# EAGLE design another_one (EAGLE 6.1)
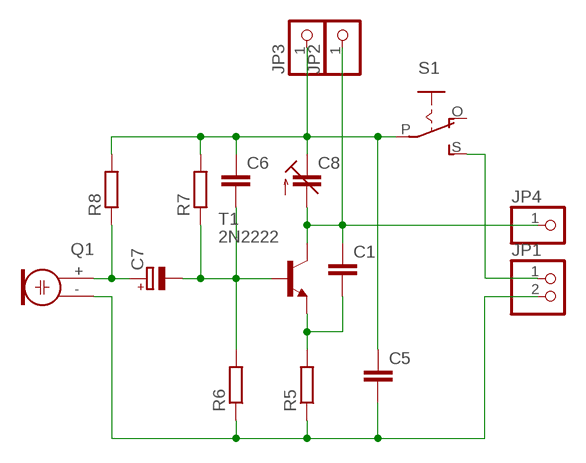
[diagram p0: schematic, sheet 1]

## Parts
C1  C-EU025-025X050  [C025-025X050]
C5  C-EU025-025X050  [C025-025X050]
C6  C-EU025-025X050  [C025-025X050]
C7  CPOL-EUE2,5-6E  [E2,5-6E]
C8  C-TRIMM808  [CTRIM808-BC]
JP1  PINHD-1X2  [1X02]
JP2  PINHD-1X1CB  [1X01-CLEANBIG]
JP3  PINHD-1X1CB  [1X01-CLEANBIG]
JP4  PINHD-1X1CB  [1X01-CLEANBIG]
Q1  ELECTRET  [9.7ELECTRET]
R5  R-EU_0204/5  [0204/5]
R6  R-EU_0207/2V  [0207/2V]
R7  R-EU_0207/2V  [0207/2V]
R8  R-EU_0207/2V  [0207/2V]
S1  EG1218S  [EG1218]
T1  2N2222  [TO92-EBC-OVAL]

## Nets
N$1: C7.+ Q1.+ R8.1
N$2: C6.2 C7.- R6.2 R7.1 T1.B
N$3: C1.2 R5.2 T1.E
N$4: C5.2 JP1.2 Q1.- R5.1 R6.1
N$5: C5.1 C6.1 C8.1(E) JP3.1 R7.2 R8.2 S1.P
N$6: C1.1 C8.2(A) JP2.1 JP4.1 T1.C
N$8: JP1.1 S1.S
Unconnected: S1.O

## Library data of the parts
C1 C5 C6 = rcl:C-EU: CAPACITOR, European symbol
C7 = rcl:CPOL-EU: POLARIZED CAPACITOR, European symbol
C8 = rcl:C-TRIMM: Trimm capacitor
JP1 = pinhead:PINHD-1X2: PIN HEADER
JP2-JP4 = adafruit:PINHD-1X1: Pin header 1x1 for 0.1" spacing With round pins
Q1 = adafruit:ELECTRET: Electret microphone Thru hole 2.54mm spacing with 9.7mm diameter
R5-R8 = rcl:R-EU_: RESISTOR, European symbol
S1 = adafruit:EG1218: SLIDING SWITCH 0.1" spacing through hole, vertical SPDT slide switch http://www.ladyada.net/library/pcb/eaglelibrary.html
T1 = adafruit:2N2222: NPN TRANSISTOR Big oval pads

## Board
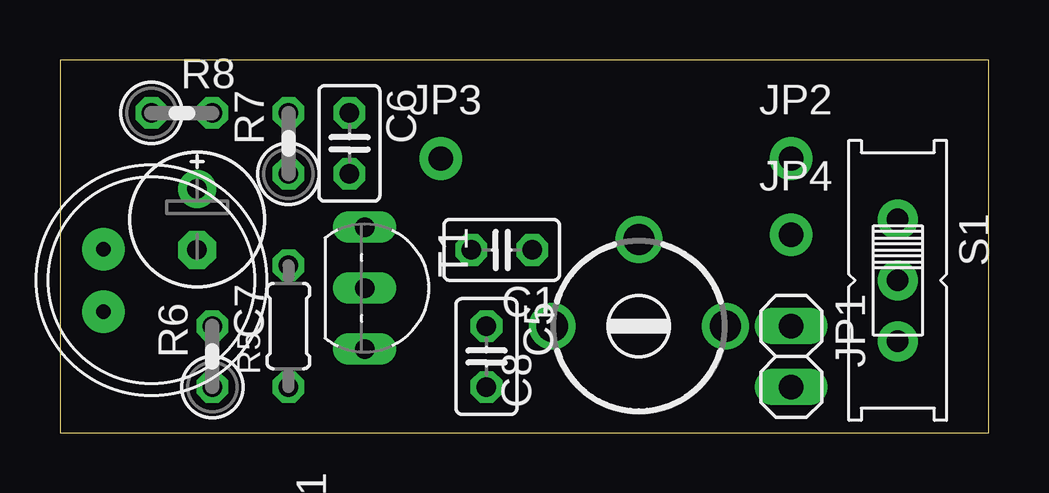
[diagram p1: board, top side]
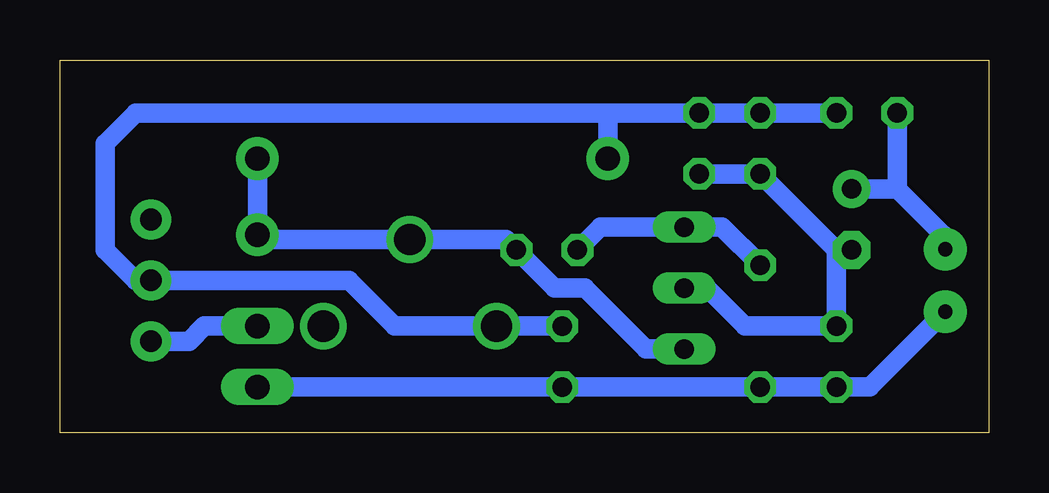
[diagram p2: board, bottom side, seen from below]

Size 38.72 x 15.54 mm. Coordinates in mm from the lower left corner, seen from the top.
Outline: 0,0 38.72,0 38.72,15.54 0,15.54 0,0
Copper layers (1*16): Top 0.035mm / dielectric 1.5mm / Bottom 0.035mm
Design rules: minimum track width 10mil, minimum drill 24mil, track to track 8mil, track to pad 8mil, pad to pad 8mil, via to via 8mil, smd to smd 8mil, copper to edge 40mil, drill to drill 8mil, minimum pad ring 10mil, minimum via ring 8mil, stop-mask expansion 4mil, vias tented up to drill 0mil, thermal gap 10mil

### Footprints (pad centres in the part's own frame; a part is rotated, then mirrored left to right if it is on the bottom)
C025-025X050 = drill 0.813 octagon: 1 -1.27,0; 2 1.27,0
E2,5-6E = drill 0.813 pad 1.575: + -1.27,0 | drill 0.813 pad 1.575 octagon: - 1.27,0
CTRIM808-BC = drill 1.3: 1 -3.607,0; 2 0,3.607; 3 3.607,0
1X02 = drill 1.016 long: 1 -1.27,0; 2 1.27,0
1X01-CLEANBIG = drill 1.016 pad 1.778: 1 0,0
9.7ELECTRET = drill 0.6 pad 1.778: + 1.3,2; - -1.3,2
0204/5 = drill 0.813 octagon: 1 -2.54,0; 2 2.54,0
0207/2V = drill 0.813 octagon: 1 -1.27,0; 2 1.27,0
EG1218 = drill 0.9 pad 1.676: O -2.54,0; P 0,0; S 2.54,0
TO92-EBC-OVAL = drill 0.813 long: B 0,-1.27; C 2.54,-1.27; E -2.54,-1.27

### Placement (x,y rotation side)
C1  18.41,7.62 180 top
C5  17.78,3.17 270 top
C6  12.06,12.06 270 top
C7  5.71,8.89 270 top
C8  24.13,4.45 0 top
JP1  30.48,3.17 270 top
JP2  30.48,11.43 0 top
JP3  15.88,11.43 0 top
JP4  30.48,8.26 0 top
Q1  3.81,6.35 90 top
R5  9.53,4.45 90 top
R6  6.35,3.17 90 top
R7  9.53,12.06 90 top
R8  5.08,13.34 0 top
S1  34.92,6.35 270 top
T1  13.97,6.03 270 top

### Tracks (layer width: path | path; a pad name or v marks a point on that pad's centre or on a via)
N$1
  Bottom 0.813: R8.1 3.81,10.16 | 3.81,10.16 C7.+ | 3.81,10.16 1.91,8.26 1.91,7.75 Q1.+
N$2
  Bottom 0.813: C7.- 6.35,7.62 | 6.35,7.62 R7.1 C6.2 | 6.35,7.62 R6.2 10.16,4.45 11.75,6.03 T1.B
N$3
  Bottom 0.813: R5.2 11.11,8.57 T1.E 16.19,8.57 C1.2
N$4
  Bottom 0.813: Q1.- 4.96,1.91 R6.1 R5.1 C5.2 JP1.2
N$5
  Bottom 0.813: R8.2 R7.2 C6.1 15.88,13.34 | C5.1 C8.1 24.77,4.45 26.67,6.35 S1.P 35.56,6.35 36.83,7.62 36.83,12.06 35.56,13.34 15.88,13.34 | JP3.1 15.88,13.34
N$6
  Bottom 0.813: JP2.1 JP4.1 30.91,8.05 C8.2 20.12,8.05 C1.1 18.1,6.03 16.83,6.03 14.29,3.49 T1.C
N$8
  Bottom 0.813: S1.S 33.34,3.81 32.7,4.45 JP1.1